# Altium schematic sheet Sheet1.SchDoc
size A4; SheetNumber: 1; SheetTotal: 2
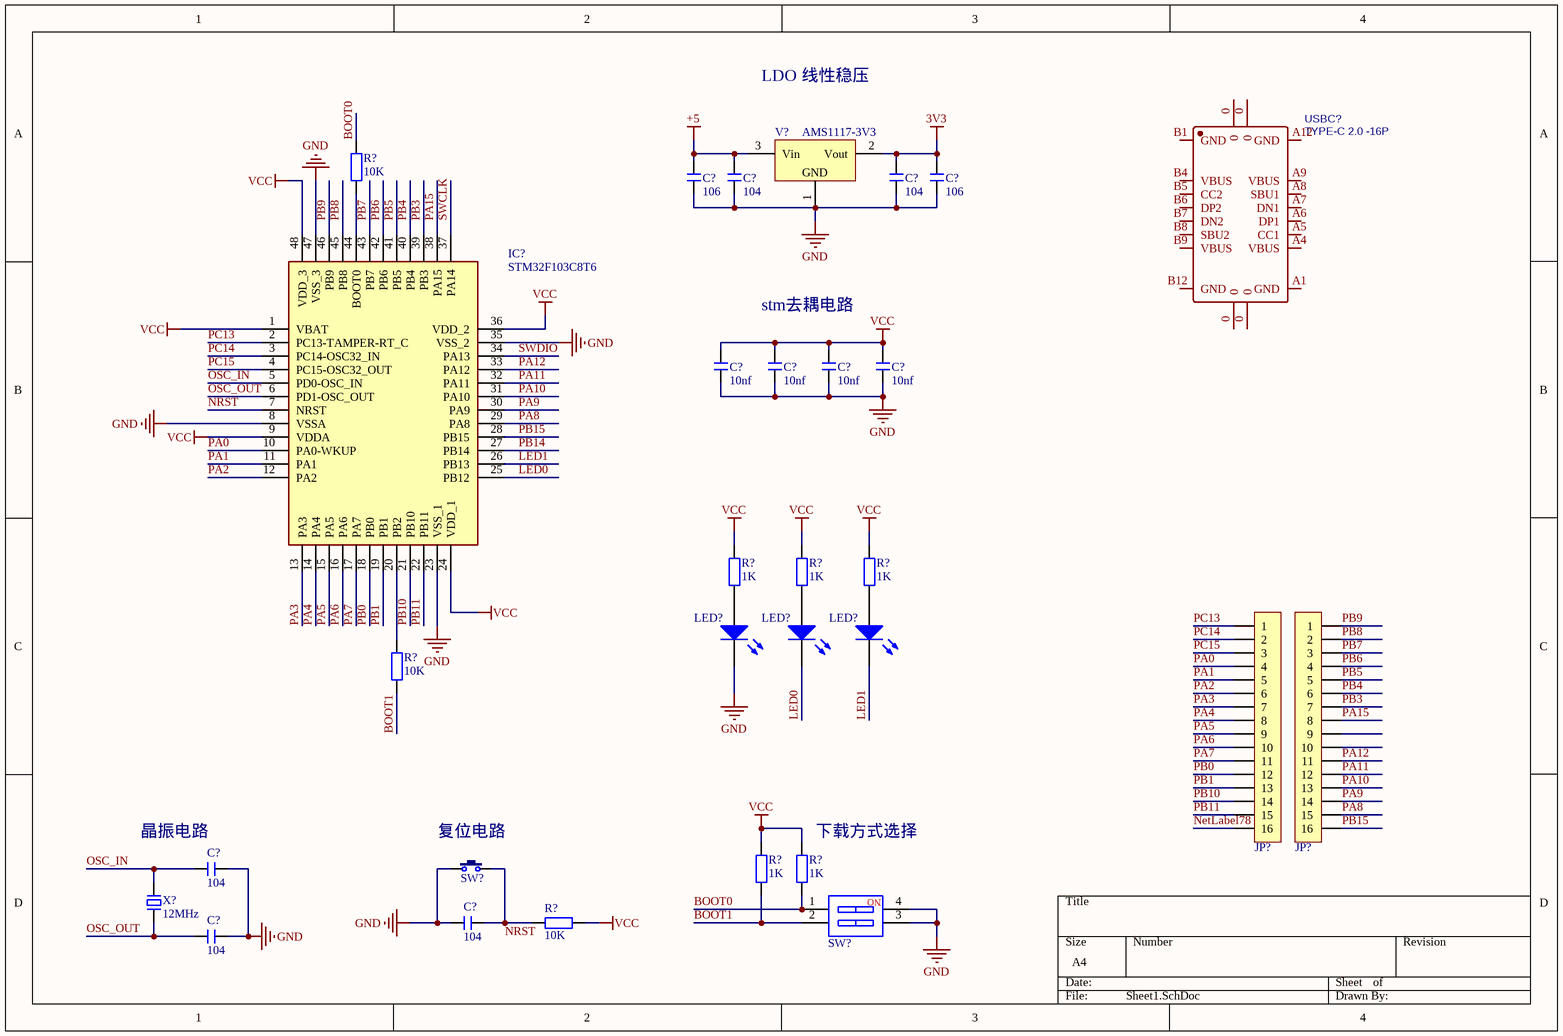
[diagram p0: Sheet1.SchDoc]

## Parts
(Parts that share a designator on the sheet are numbered #1, #2 ... from top to bottom, then left to right.)
C?#1  106  [C0201_L]
C?#2  104  [C0201_L]
C?#3  104  [C0201_L]
C?#4  106  [C0201_L]
C?#5  10nf  [C0201_L]
C?#6  10nf  [C0201_L]
C?#7  10nf  [C0201_L]
C?#8  10nf  [C0201_L]
C?#9  104  [C0201_L]
C?#10  104  [C0201_L]
C?#11  104  [C0201_L]
IC?  STM32F103C8T6  [QFP50P900X900X160-48N]
JP?#1  HDR-1X16  [HDR2.54-LI-16P]  (value not drawn)
JP?#2  HDR-1X16  [HDR2.54-LI-16P]  (value not drawn)
LED?#1  (no value)  [LED0603_G]
LED?#2  (no value)  [LED0603_G]
LED?#3  (no value)  [LED0603_G]
R?#1  10K  [R0805_L]
R?#2  1K  [R0805_L]
R?#3  1K  [R0805_L]
R?#4  1K  [R0805_L]
R?#5  10K  [R0805_L]
R?#6  1K  [R0805_L]
R?#7  1K  [R0805_L]
R?#8  10K  [R0805_L]
SW?#1  3x6x5  [SW SMD-3*6*5]  (value not drawn)
SW?#2  SW-2P  [SW DIP-2P]  (value not drawn)
USBC?  TYPE-C 2.0 -16P  [USB-C-SMD_TYPE-C-USB-5]
V?  AMS1117-3V3  [SOT223_L]
X?  12MHz  [OSC 5032-2P]

## Nets
3V3: C?#3.2 C?#4.2 V?.2(Vout)
+5: C?#1.2 C?#2.2 V?.3(Vin)
GND: C?#1.1 C?#2.1 C?#3.1 C?#4.1 C?#5.1 C?#6.1 C?#7.1 C?#8.1 C?#9.2 C?#10.1 C?#11.2 IC?.8(VSSA) IC?.23(VSS_1) IC?.35(VSS_2) IC?.47(VSS_3) LED?#1.2(K) SW?#1.1 SW?#2.3 SW?#2.4 V?.1(GND)
VCC: C?#5.2 C?#6.2 C?#7.2 C?#8.2 IC?.1(VBAT) IC?.9(VDDA) IC?.24(VDD_1) IC?.36(VDD_2) IC?.48(VDD_3) R?#2.2 R?#3.2 R?#4.2 R?#6.2 R?#7.2 R?#8.2
BOOT0: R?#1.2 R?#7.1 SW?#2.1
BOOT1: R?#5.1 R?#6.1 SW?#2.2
LED0: IC?.25(PB12) LED?#2.2(K)
LED1: IC?.26(PB13) LED?#3.2(K)
NetLabel78: JP?#1.16
NRST: C?#10.2 IC?.7(NRST) R?#8.1 SW?#1.2
OSC_IN: C?#9.1 IC?.5(PD0-OSC_IN) X?.2
OSC_OUT: C?#11.1 IC?.6(PD1-OSC_OUT) X?.1
PA0: IC?.10(PA0-WKUP) JP?#1.4
PA1: IC?.11(PA1) JP?#1.5
PA2: IC?.12(PA2) JP?#1.6
PA3: IC?.13(PA3) JP?#1.7
PA4: IC?.14(PA4) JP?#1.8
PA5: IC?.15(PA5) JP?#1.9
PA6: IC?.16(PA6) JP?#1.10
PA7: IC?.17(PA7) JP?#1.11
PA8: IC?.29(PA8) JP?#2.15
PA9: IC?.30(PA9) JP?#2.14
PA10: IC?.31(PA10) JP?#2.13
PA11: IC?.32(PA11) JP?#2.12
PA12: IC?.33(PA12) JP?#2.11
PA15: IC?.38(PA15) JP?#2.8
PB0: IC?.18(PB0) JP?#1.12
PB1: IC?.19(PB1) JP?#1.13
PB3: IC?.39(PB3) JP?#2.7
PB4: IC?.40(PB4) JP?#2.6
PB5: IC?.41(PB5) JP?#2.5
PB6: IC?.42(PB6) JP?#2.4
PB7: IC?.43(PB7) JP?#2.3
PB8: IC?.45(PB8) JP?#2.2
PB9: IC?.46(PB9) JP?#2.1
PB10: IC?.21(PB10) JP?#1.14
PB11: IC?.22(PB11) JP?#1.15
PB14: IC?.27(PB14)
PB15: IC?.28(PB15) JP?#2.16
PC13: IC?.2(PC13-TAMPER-RT_C) JP?#1.1
PC14: IC?.3(PC14-OSC32_IN) JP?#1.2
PC15: IC?.4(PC15-OSC32_OUT) JP?#1.3
SWCLK: IC?.37(PA14)
SWDIO: IC?.34(PA13)
NetIC?_20: IC?.20(PB2) R?#5.2
NetIC?_44: IC?.44(BOOT0) R?#1.1
NetLED?#1_1: LED?#1.1(A) R?#2.1
NetLED?#2_1: LED?#2.1(A) R?#3.1
NetLED?#3_1: LED?#3.1(A) R?#4.1

Not connected (* = marked no-connect by the designer): JP?#2 9 10; USBC? 0 A1(GND) A4(VBUS) A5(CC1) A6(DP1) A7(DN1) A8(SBU1) A9(VBUS) A12(GND) B1(GND) B4(VBUS) B5(CC2) B6(DP2) B7(DN2) B8(SBU2) B9(VBUS) B12(GND)

## Notes on the sheet
- LDO 线性稳压
- (near C?#6) stm去耦电路
- 晶振电路
- (near SW?#1) 复位电路
- (near R?#7) 下载方式选择
- (in symbol SW-2P) NO

## Library data of the parts
C?#1-C?#11 = C: 贴片电容; BOM名称: 无极性贴片电容; 淘宝ID: 封装库来自淘宝 ID：黄晶宝石; 联系售后，技术支持: https://shop463601444.taobao.com; 唯一出售店铺网址: https://shop463601444.taobao.com
IC? = stm32f103c8t6: Integrated Circuit; Manufacturer_Name: STMicroelectronics; Datasheet Link: http://media.digikey.com/pdf/Data%20Sheets/ST%20Microelectronics%20PDFS/STM32F103x8,B.pdf; Height: 1.6mm; Manufacturer_Part_Number: stm32f103c8t6; Mouser Part Number: 511-STM32F103C8T6; Mouser Price/Stock: https://www.mouser.co.uk/ProductDetail/STMicroelectronics/STM32F103C8T6?qs=bhCVus9SdFtq6kqxsU5%2FDA%3D%3D; Arrow Part Number: STM32F103C8T6; Arrow Price/Stock: https://www.arrow.com/en/products/stm32f103c8t6/stmicroelectronics?region=nac
JP?#1 JP?#2 = Header 16: 16P接插件; 学习资源: 最新版本发布https://item.taobao.com/item.htm?id=566775463719; 版权归属: 封装库来自淘宝 ID：黄晶宝石; BOM名称: 16P接插件
LED?#1-LED?#3 = LED-SMD: 贴片LED; 版权归属: 封装库来自淘宝 ID：黄晶宝石; BOM名称: 贴片LED
R?#1-R?#8 = R: 贴片电阻; 版权归属: 来自淘宝 ID：黄晶宝石; 封装库来自淘宝卖家 ID：黄晶宝石: 其他店铺购入均为盗版，不享受售后技术支持服务，请立即申请退款; BOM名称: 贴片电阻; 联系售后: https://item.taobao.com/item.htm?id=566775463719
SW?#1 = TSW 3x6: 3x6轻触开关; 版权归属: 封装库来自淘宝 ID：黄晶宝石; BOM名称: 3x6轻触开关; 学习资源: https://shop463601444.taobao.com
SW?#2 = SW-2P: 2路编码开关; 淘宝ID: 封装库来自淘宝 ID：黄晶宝石; BOM名称: 2路编码开关; 学习资源: https://shop463601444.taobao.com
USBC? = USB2.0 Type-C 16Pin母座: USB2.0 Type-C 母座 16Pin; BOM_Supplier: LCSC; BOM_Manufacturer Part: -; spiceSymbolName: TYPE-C 3.1 -16P_C168689
V? = AMS1117: 三端稳压芯片; BOM名称: 稳压芯片; 淘宝ID: 封装库来自淘宝 ID：黄晶宝石; 欢迎光临淘宝店铺: 最新版本发布https://item.taobao.com/item.htm?id=566775463719
X? = XTAL-2P: 2脚无源脚晶振; 版权归属: 封装库来自淘宝卖家 ID：黄晶宝石; BOM名称: 2脚无源脚晶振; 学习资源: https://shop463601444.taobao.com